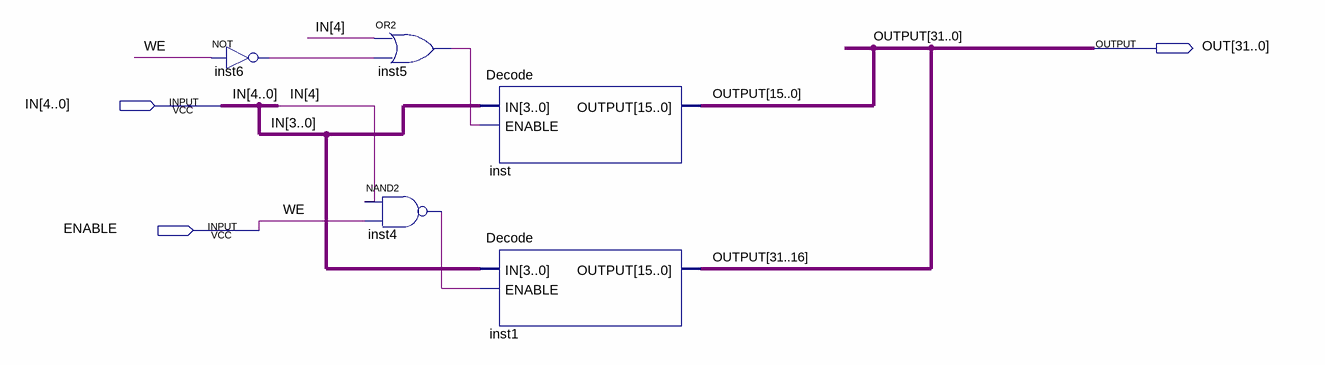
[diagram p0: schematic sheet]
// Quartus schematic Decode32bit.bdf as structural Verilog: 5 symbols, 3 pins
module Decode32bit (
  input  [4:0] IN,
  input  ENABLE,
  output [31:0] OUT
);

  wire inst4_out, inst5_out, inst6_out;

  not inst6 (inst6_out, ENABLE);
  or inst5 (inst5_out, IN[4], inst6_out);
  nand inst4 (inst4_out, IN[4], ENABLE);
  Decode inst (.IN(IN[3:0]), .ENABLE(inst5_out), .OUTPUT(OUT[15:0]));
  Decode inst1 (.IN(IN[3:0]), .ENABLE(inst4_out), .OUTPUT(OUT[31:16]));

  // Other names for the same wires on the sheet: WE = ENABLE; OUTPUT[31:0] = OUT
endmodule
